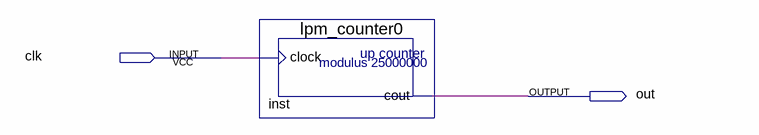
[diagram p0: schematic sheet]
// Quartus schematic Divisor.bdf as structural Verilog: 1 symbols, 2 pins
module Divisor (
  input  clk,
  output out
);

  lpm_counter0 inst (.clock(clk), .cout(out));
endmodule
